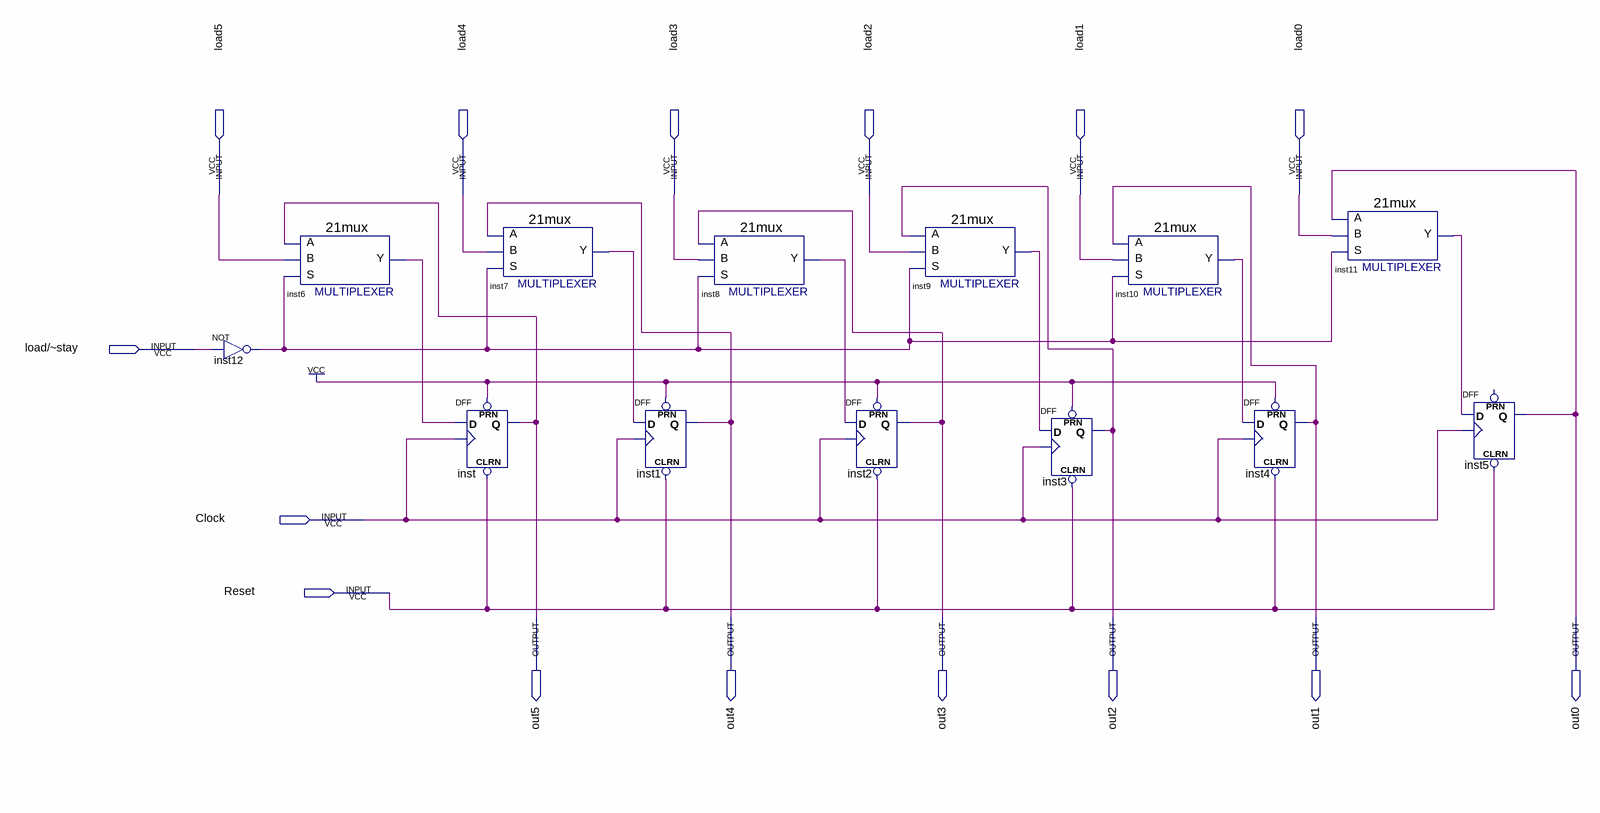
[diagram p0: schematic sheet]
// Quartus schematic 6BitRegister.bdf as structural Verilog: 13 symbols, 15 pins
module \6BitRegister  (
  input  load5,
  input  load4,
  input  load3,
  input  load2,
  input  load1,
  input  load0,
  input  \load/~stay ,
  input  Clock,
  input  Reset,
  output out5,
  output out4,
  output out3,
  output out2,
  output out1,
  output out0
);

  wire inst6_y, inst7_y, inst8_y, inst9_y, inst10_y, inst11_y, inst12_out;

  not inst12 (inst12_out, \load/~stay );
  \21mux  inst6 (.S(inst12_out), .B(load5), .A(out5), .Y(inst6_y));
  DFF inst (.CLRN(Reset), .CLK(Clock), .D(inst6_y), .PRN(1'b1), .Q(out5));
  \21mux  inst7 (.S(inst12_out), .B(load4), .A(out4), .Y(inst7_y));
  DFF inst1 (.CLRN(Reset), .CLK(Clock), .D(inst7_y), .PRN(1'b1), .Q(out4));
  \21mux  inst8 (.S(inst12_out), .B(load3), .A(out3), .Y(inst8_y));
  DFF inst2 (.CLRN(Reset), .CLK(Clock), .D(inst8_y), .PRN(1'b1), .Q(out3));
  \21mux  inst9 (.S(inst12_out), .B(load2), .A(out2), .Y(inst9_y));
  DFF inst3 (.CLRN(Reset), .CLK(Clock), .D(inst9_y), .PRN(1'b1), .Q(out2));
  \21mux  inst10 (.S(inst12_out), .B(load1), .A(out1), .Y(inst10_y));
  DFF inst4 (.CLRN(Reset), .CLK(Clock), .D(inst10_y), .PRN(1'b1), .Q(out1));
  \21mux  inst11 (.S(inst12_out), .B(load0), .A(out0), .Y(inst11_y));
  DFF inst5 (.CLRN(Reset), .CLK(Clock), .D(inst11_y), .Q(out0));  // open: PRN
endmodule
